# EAGLE design uSD_socket_breakout (EAGLE 6.5.0)
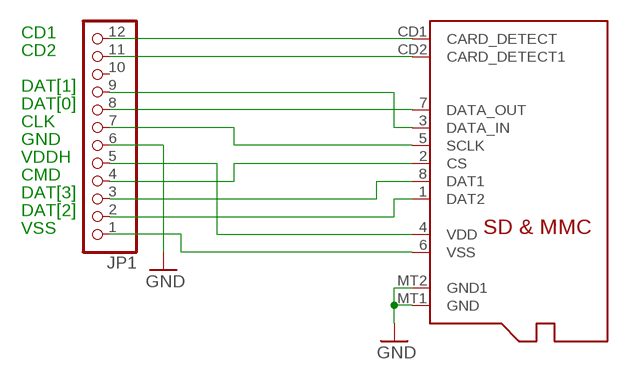
[diagram p0: schematic, sheet 1]

## Parts
JP1  PINHD-1X12  [1X12]
U$1  MICROSD  [MICROSD]

## Nets
GND: JP1.6 U$1.MT1(GND) U$1.MT2(GND1)
N$1: JP1.2 U$1.1(DAT2)
N$2: JP1.3 U$1.8(DAT1)
N$3: JP1.4 U$1.2(CS)
N$4: JP1.8 U$1.7(DATA_OUT)
N$5: JP1.7 U$1.5(SCLK)
N$6: JP1.9 U$1.3(DATA_IN)
N$7: JP1.12 U$1.CD1(CARD_DETECT)
N$8: JP1.11 U$1.CD2(CARD_DETECT1)
VDD: JP1.5 U$1.4(VDD)
VSS: JP1.1 U$1.6(VSS)
Unconnected: JP1.10

## Notes on the sheet
- CD1
- CD2
- DAT[1]
- DAT[0]
- CLK
- GND
- VDDH
- CMD
- DAT[3]
- DAT[2]
- VSS

## Library data of the parts
JP1 = adafruit:PINHD-1X12: PIN HEADER
U$1 = adafruit:MICROSD: Micro-SD / Transflash card holder with SPI pinout For the 3M # 2908-05WB-MG and/or 4UCON #19656 push-push type

## Board
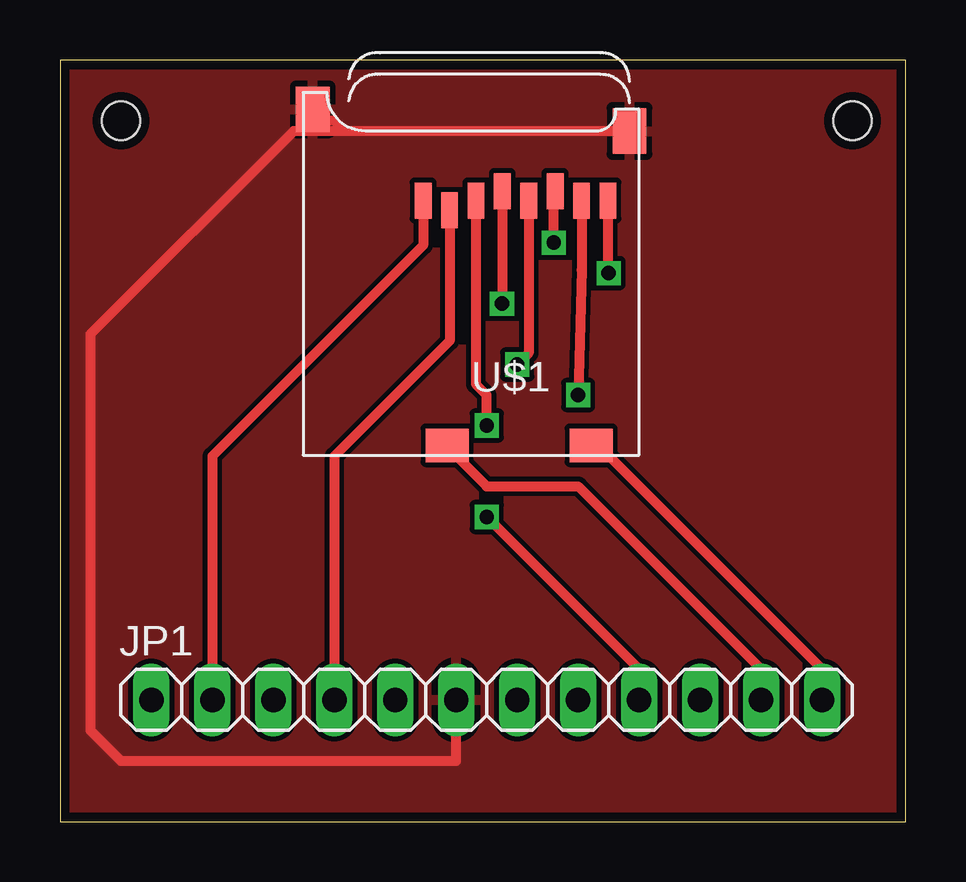
[diagram p1: board, top side]
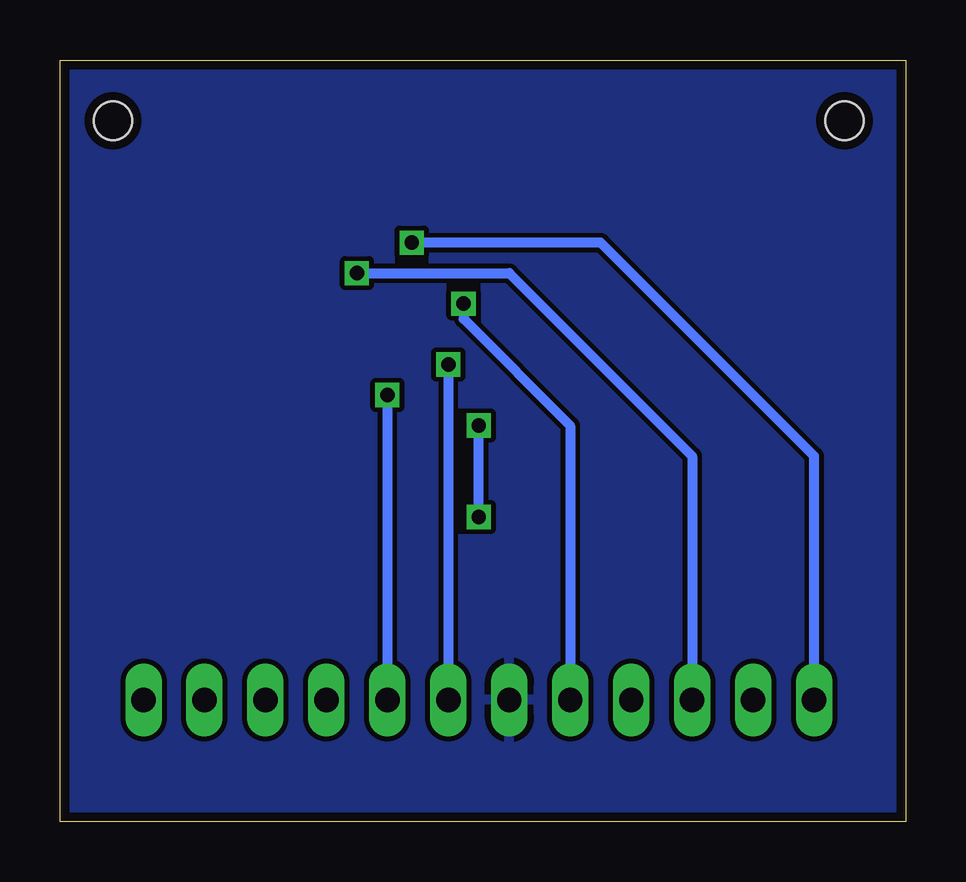
[diagram p2: board, bottom side, seen from below]

Size 35.23 x 31.74 mm. Coordinates in mm from the lower left corner, seen from the top.
Outline: 0,0 35.23,0 35.23,31.74 0,31.74 0,0
Copper layers (1*16): Top 0.0178mm / dielectric 59mil / Bottom 0.0178mm
Design rules "epl-lpkf": minimum track width 8mil, minimum drill 0.35mm, track to track 8mil, track to pad 8mil, pad to pad 8mil, via to via 8mil, smd to smd 8mil, copper to edge 15mil, drill to drill 15mil, minimum pad ring 8mil, minimum via ring 8mil, stop-mask expansion 3mil, vias tented up to drill 0mil, thermal gap 10mil
Holes 1.6 mm at 2.54,29.21 33.02,29.21

### Footprints (pad centres in the part's own frame; a part is rotated, then mirrored left to right if it is on the bottom)
1X12 = drill 1.016 long: 1 -13.97,0; 2 -11.43,0; 3 -8.89,0; 4 -6.35,0; 5 -3.81,0; 6 -1.27,0; 7 1.27,0; 8 3.81,0; 9 6.35,0; 10 8.89,0; 11 11.43,0; 12 13.97,0
MICROSD = smd 0.7 x 1.5: 1 9,-10.64; 2 7.9,-10.24; 3 6.8,-10.64; 4 5.7,-11.04; 5 4.6,-10.64; 6 3.5,-11.04; 7 2.4,-10.64; 8 1.3,-10.64 | smd 1.8 x 1.4: CD1 2,-0.44; CD2 8,-0.44 | smd 1.4 x 1.9: MT1 0.4,-13.54; MT2 13.6,-14.44

### Placement (x,y rotation side)
JP1  17.78,5.08 0 top
U$1  24.13,15.24 180 top

### Tracks (layer width: path | path; a pad name or v marks a point on that pad's centre or on a via)
GND
  Top 0.406: U$1.MT1 11.86,28.78 | 11.86,28.78 11.43,29.21 11,29.21 U$1.MT2 | 11.86,28.78 9.73,28.78 1.27,20.32 1.27,3.81 2.54,2.54 16.51,2.54 JP1.6
  pour Top: 0,31.75 35.56,31.75 35.56,0 -1.27,0
  pour Bottom: 0,31.75 35.56,31.75 35.56,0 -1.27,0
N$1
  Top 0.406: U$1.1 15.13,24.02 6.35,15.24 JP1.2
N$2  (via drill 0.6)
  Top 0.406: U$1.8 22.83,22.89 v22.86,22.86
  Bottom 0.406: v22.86,22.86 16.51,22.86 8.89,15.24 JP1.3
N$3
  Top 0.406: U$1.2 16.23,20.04 11.43,15.24 JP1.4
N$4  (via drill 0.6)
  Top 0.406: U$1.7 21.73,23 v21.59,17.78
  Bottom 0.406: v21.59,17.78 JP1.8
N$5  (via drill 0.6)
  Top 0.406: U$1.5 19.53,19.53 v19.05,19.05
  Bottom 0.406: v19.05,19.05 JP1.7
N$6  (via drill 0.6)
  Top 0.406: U$1.3 17.33,18.23 17.78,17.78 v17.78,16.51 | v17.78,12.7 24.13,6.35 JP1.9
  Bottom 0.406: v17.78,12.7 v17.78,16.51
N$7
  Top 0.406: U$1.CD1 22.42,15.68 31.75,6.35 JP1.12
N$8
  Top 0.406: U$1.CD2 16.13,15.62 17.78,13.97 21.59,13.97 29.21,6.35 JP1.11
VDD  (via drill 0.6)
  Top 0.406: U$1.4 v18.43,21.59 v18.41,21.59
  Bottom 0.406: v18.41,21.59 18.41,20.96 13.97,16.51 JP1.5
VSS  (via drill 0.6)
  Top 0.406: v20.57,24.13 20.57,26.22 U$1.6
  Bottom 0.406: JP1.1 3.81,15.24 12.7,24.13 v20.57,24.13